# Altium schematic sheet Connector.SchDoc
size A4; SheetNumber: 5; SheetTotal: 5
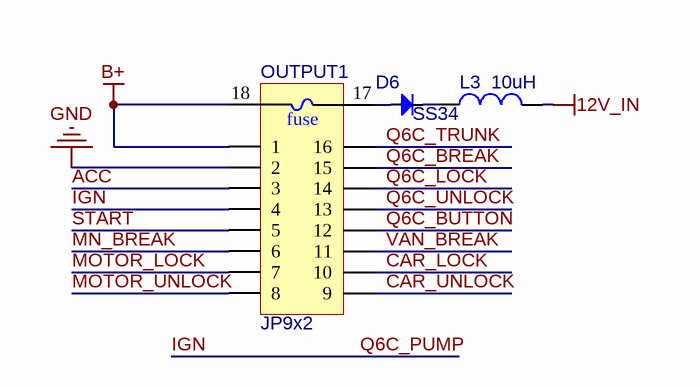
[diagram p0: Connector.SchDoc]

## Parts
D6  SS34  [DIO-SMD-106]
L3  10uH  [INDUCTOR_SMD_7X7MM]
OUTPUT1  JP9x2  [9x2_JP200]

## Nets
12V_IN: L3.2
B+: OUTPUT1.1 OUTPUT1.18
GND: OUTPUT1.2
ACC: OUTPUT1.3
CAR_LOCK: OUTPUT1.10
CAR_UNLOCK: OUTPUT1.9
IGN: OUTPUT1.4  [also labelled Q6C_PUMP]
MN_BREAK: OUTPUT1.6
MOTOR_LOCK: OUTPUT1.7
MOTOR_UNLOCK: OUTPUT1.8
Q6C_BREAK: OUTPUT1.15
Q6C_BUTTON: OUTPUT1.12
Q6C_LOCK: OUTPUT1.14
Q6C_TRUNK: OUTPUT1.16
Q6C_UNLOCK: OUTPUT1.13
START: OUTPUT1.5
VAN_BREAK: OUTPUT1.11
NetD6_1: D6.1(A) OUTPUT1.17
NetD6_2: D6.2(K) L3.1

## Notes on the sheet
- Author:
- Title:
- Size:
- A4
- Project:
- Approved:
- Revision:
- Modified Date:
- CONFIDENTIAL
- Date:
- SW Version:
- (in symbol JP9x2_1) fuse

## Library data of the parts
D6 = Diode SMD: Default Diode; Code - JEDEC: DO-214-AB; Value: 1N5007; Published: 8-Jun-2000; Revision: July-2002: Re-released for DXP Platform.; Publisher: Altium Limited
L3 = Inductor_SMD: Inductor; Value: 150 mH
OUTPUT1 = JP9x2_1: WR-PHD 2.54 mm Dual Socket Header; Manufacturer: W¨¹rth Elektronik eiSos GmbH; partNo: 61301821821; ComponentLink1 Description: Manufacturer; ComponentLink2 Description: Datasheet; NoPins: 18; Created Date: 29 March 2013; ComponentLink1URL: http://www.we-online.com; ComponentLink2URL: http://katalog.we-online.de/em/datasheet/6130xx21821.pdf; Created by: Karrer Zheng